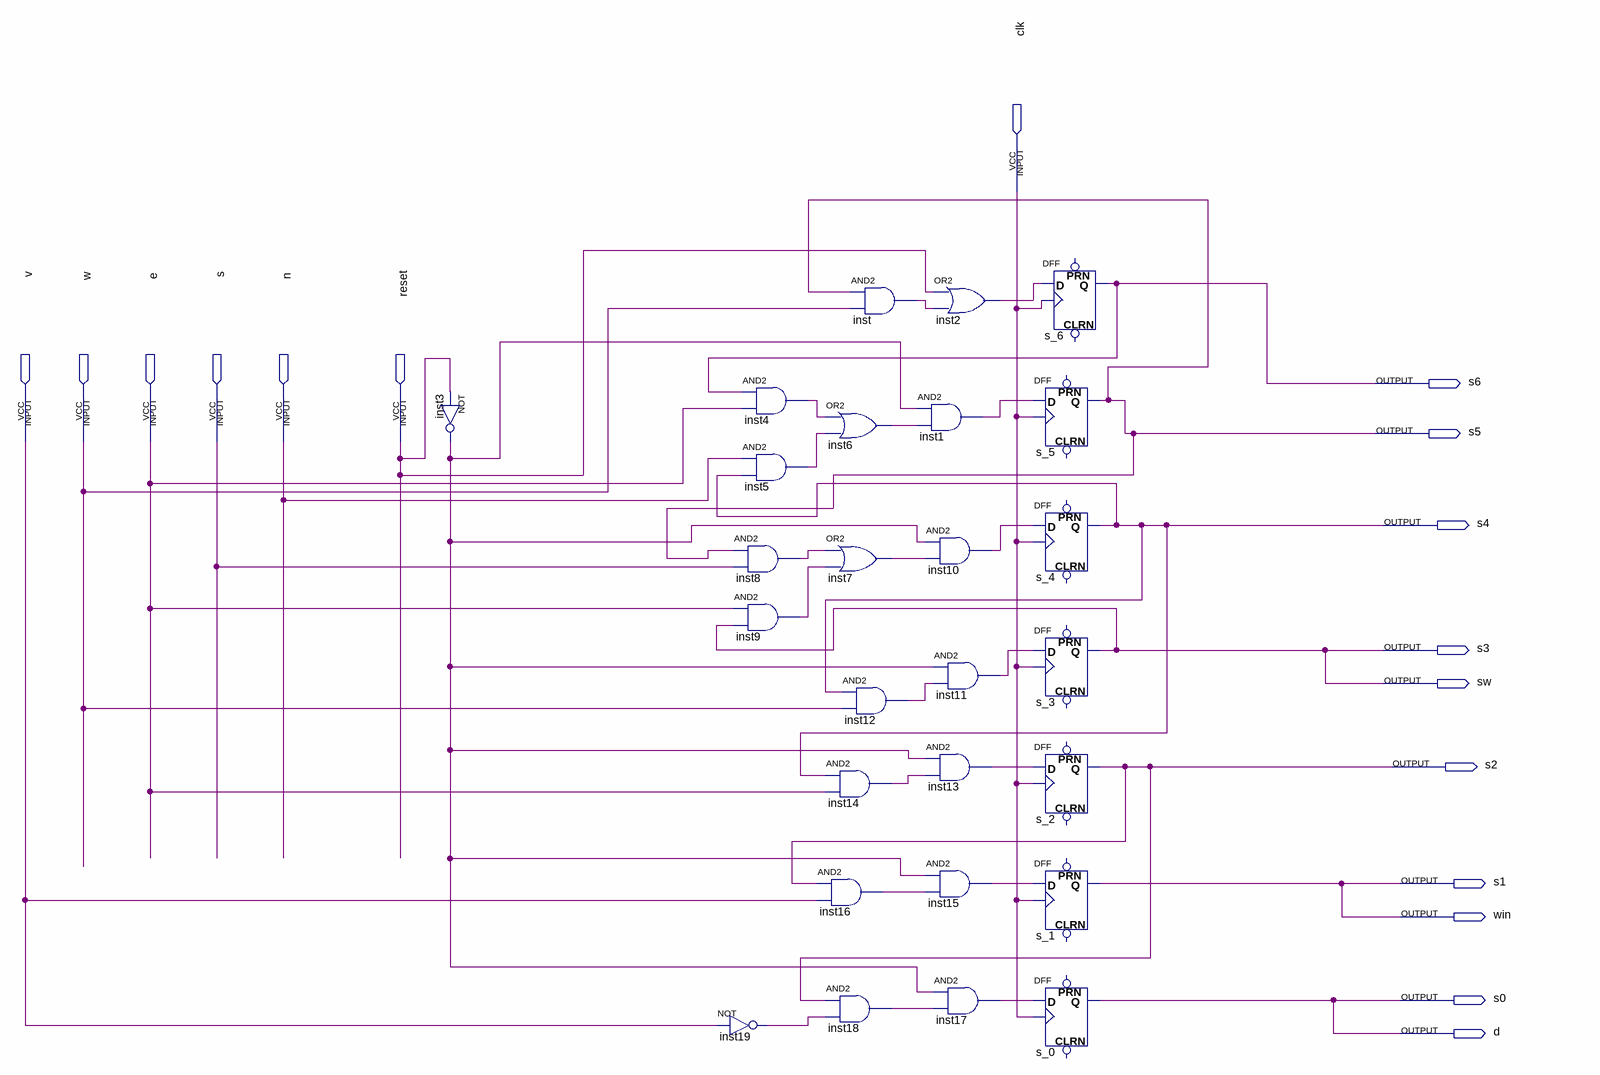
[diagram p0: schematic sheet]
// Quartus schematic room.bdf as structural Verilog: 27 symbols, 17 pins
module room (
  input  clk,
  input  v,
  input  w,
  input  e,
  input  s,
  input  n,
  input  reset,
  output s6,
  output s5,
  output s4,
  output s3,
  output sw,
  output s2,
  output s1,
  output win,
  output s0,
  output d
);

  wire inst1_out, inst2_out, inst3_out, inst4_out, inst5_out, inst6_out, inst7_out, inst8_out, inst9_out,
       inst10_out, inst11_out, inst12_out, inst13_out, inst14_out, inst15_out, inst16_out, inst17_out,
       inst18_out, inst19_out, inst_out;

  not inst3 (inst3_out, reset);
  and inst4 (inst4_out, s6, e);
  and inst5 (inst5_out, n, s4);
  and inst8 (inst8_out, s5, s);
  and inst9 (inst9_out, e, s3);
  not inst19 (inst19_out, v);
  or inst6 (inst6_out, inst4_out, inst5_out);
  or inst7 (inst7_out, inst8_out, inst9_out);
  and inst12 (inst12_out, s4, w);
  and inst14 (inst14_out, s4, e);
  and inst16 (inst16_out, s2, v);
  and inst18 (inst18_out, s2, inst19_out);
  and inst (inst_out, s5, w);
  or inst2 (inst2_out, reset, inst_out);
  and inst1 (inst1_out, inst3_out, inst6_out);
  and inst10 (inst10_out, inst3_out, inst7_out);
  and inst11 (inst11_out, inst3_out, inst12_out);
  and inst13 (inst13_out, inst3_out, inst14_out);
  and inst15 (inst15_out, inst3_out, inst16_out);
  and inst17 (inst17_out, inst3_out, inst18_out);
  DFF s_6 (.CLK(clk), .D(inst2_out), .Q(s6));  // open: CLRN, PRN
  DFF s_5 (.CLK(clk), .D(inst1_out), .Q(s5));  // open: CLRN, PRN
  DFF s_4 (.CLK(clk), .D(inst10_out), .Q(s4));  // open: CLRN, PRN
  DFF s_3 (.CLK(clk), .D(inst11_out), .Q(s3));  // open: CLRN, PRN
  DFF s_2 (.CLK(clk), .D(inst13_out), .Q(s2));  // open: CLRN, PRN
  DFF s_1 (.CLK(clk), .D(inst15_out), .Q(s1));  // open: CLRN, PRN
  DFF s_0 (.CLK(clk), .D(inst17_out), .Q(d));  // open: CLRN, PRN

  assign s0 = d;
  assign sw = s3;
  assign win = s1;
endmodule
